# Altium project Discharge.PrjPcb
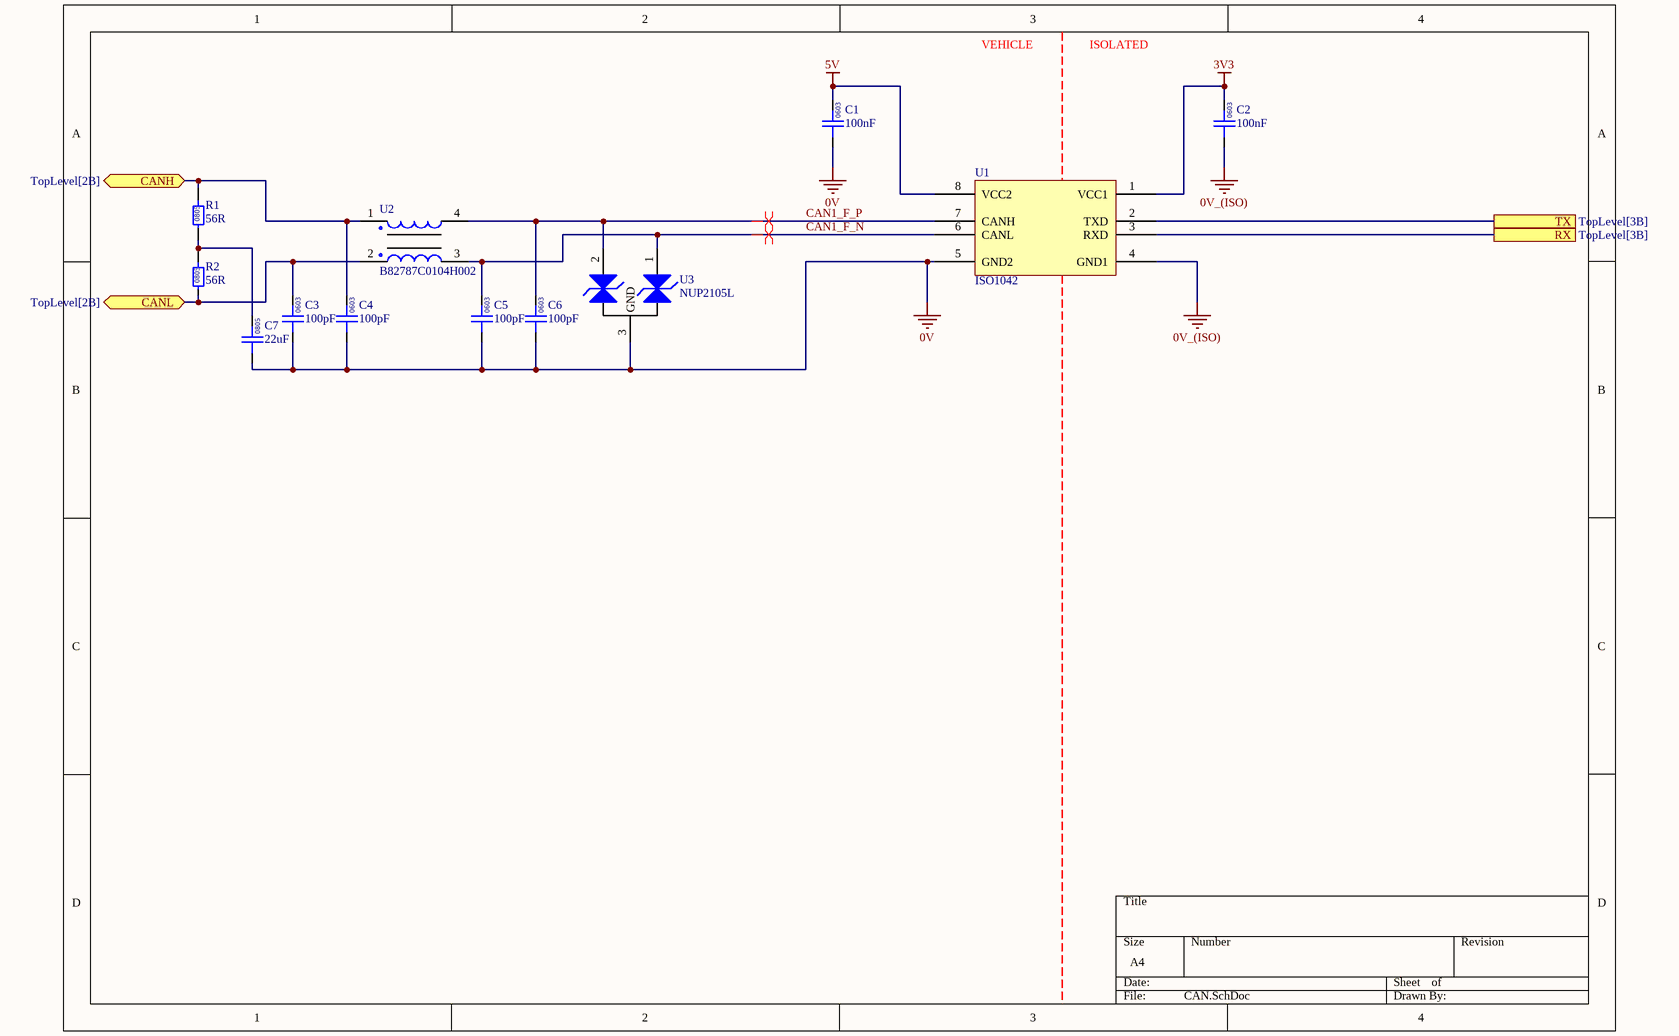
[diagram p0: CAN.SchDoc]
6 sheets, 94 parts. Net scope: flat (ports and power ports of the same name join across sheets).
Board files: Discharge_B1.PcbDoc, Discharge_B2.PcbDoc
Sheets:
  CAN.SchDoc
  Power Supply.SchDoc
  Safety Loop.SchDoc
  Discharge.SchDoc
  HV Sense.SchDoc
  TSAL.SchDoc

## Sheet CAN.SchDoc
size A4; SheetNumber: 2; SheetTotal: 11

### Parts
C1  100nF  [0603]
C2  100nF  [0603]
C3  100pF  [0603]
C4  100pF  [0603]
C5  100pF  [0603]
C6  100pF  [0603]
C7  22uF  [0805]
R1  56R  [0805]
R2  56R  [0805]
U1  ISO1042  [TI-SOIC-8]
U2  B82787C0104H002  [TDK 4-PC Pad]
U3  NUP2105L  [ON SOT-23]

### Ports
CANH (bidir, see TopLevel[2B]), CANL (bidir, see TopLevel[2B]), RX (see TopLevel[3B]), TX (see TopLevel[3B])

### Nets
0V: C1.1 C3.1 C4.1 C5.1 C6.1 C7.1 U1.5(GND2) U3.3(GND)
0V_(ISO): C2.1 U1.4(GND1)
3V3: C2.2 U1.1(VCC1)
5V: C1.2 U1.8(VCC2)
CAN1_F_N: C5.2 U1.6(CANL) U2.3 U3.1(CAN_H)
CAN1_F_P: C6.2 U1.7(CANH) U2.4 U3.2(CAN_L)
NetC3_2: C3.2 R2.1 U2.2 ; port CANL
NetC4_2: C4.2 R1.2 U2.1 ; port CANH
NetC7_2: C7.2 R1.1 R2.2
NetU1_2: U1.2(TXD) ; port TX
NetU1_3: U1.3(RXD) ; port RX

### Layout directives
differential pair: CAN1_F_N, CAN1_F_P

### Notes on the sheet
- VEHICLE
- ISOLATED
- (in symbol GCM188L81H104KA57D) 0603
- (in symbol GRM21BR61A226ME51L) 0805
- (in symbol GRM1885C1H101JA01D) 0603
- (in symbol RC0805FR0756RL) 0805

### Library data of the parts
C1 C2 = GCM188L81H104KA57D: Manufacturer: muRata; Rated Voltage: 50V; Tolerance: ±10%; Material: MLCC; Temperature Rating: X8L; Part Number: GCM188L81H104KA57D; Value: 100nF; Digikey Part Number: 490-6049-1-ND
C3-C6 = GRM1885C1H101JA01D: Manufacturer: Murata Electronics; Rated Voltage: 50V; Tolerance: ±5%; Material: MLCC; Temperature Rating: C0G, NP0; Part Number: GRM1885C1H101JA01D; Value: 100pF; Digikey Part Number: 490-1427-1-ND
C7 = GRM21BR61A226ME51L: Manufacturer: muRata; Rated Voltage: 10V; Tolerance: 20%; Material: MLCC; Temperature Rating: X5R; Part Number: GRM21BR61A226ME51L; Value: 22uF; Digikey Part Number: 490-10511-1-ND
R1 R2 = RC0805FR0756RL: Manufacturer: YAGEO; Tolerance: 0.01; Rated Power: 0.125W; Part Number: RC0805FR0756RL; Value: 56R; Material: FR-07; Digikey Part Number: 311-56.0CRCT-ND
U1 = ISO1042: IC CAN TRANSCEIVER 1/1 8SOIC; Manufacturer: Texas Instruments; Part Number: ISO1042; Digikey Part Number: 296-ISO1042BQDWVQ1-ND
U2 = B82787C0104H002: Manufacturer: EPCOS (TDK); Value: 100µH @ 100kHz; Impedance: 5.8 kOhms @ 10MHz; Rated Current: 150mA; Part Number: B82787C0104H002; Material: Wirewound; Digikey Part Number: 495-4598-1-ND
U3 = NUP2105L: Dual Line CAN Bus Protector; Manufacturer: ON Semiconductor; Part Number: NUP2105L; Digikey Part Number: NUP2105LT1GOSCT-ND; Digikey Link: https://www.digikey.com/product-detail/en/on-semiconductor/NUP2105LT1G/NUP2105LT1GOSCT-ND/1485001

## Sheet Power Supply.SchDoc
size A4; SheetNumber: 3; SheetTotal: 11
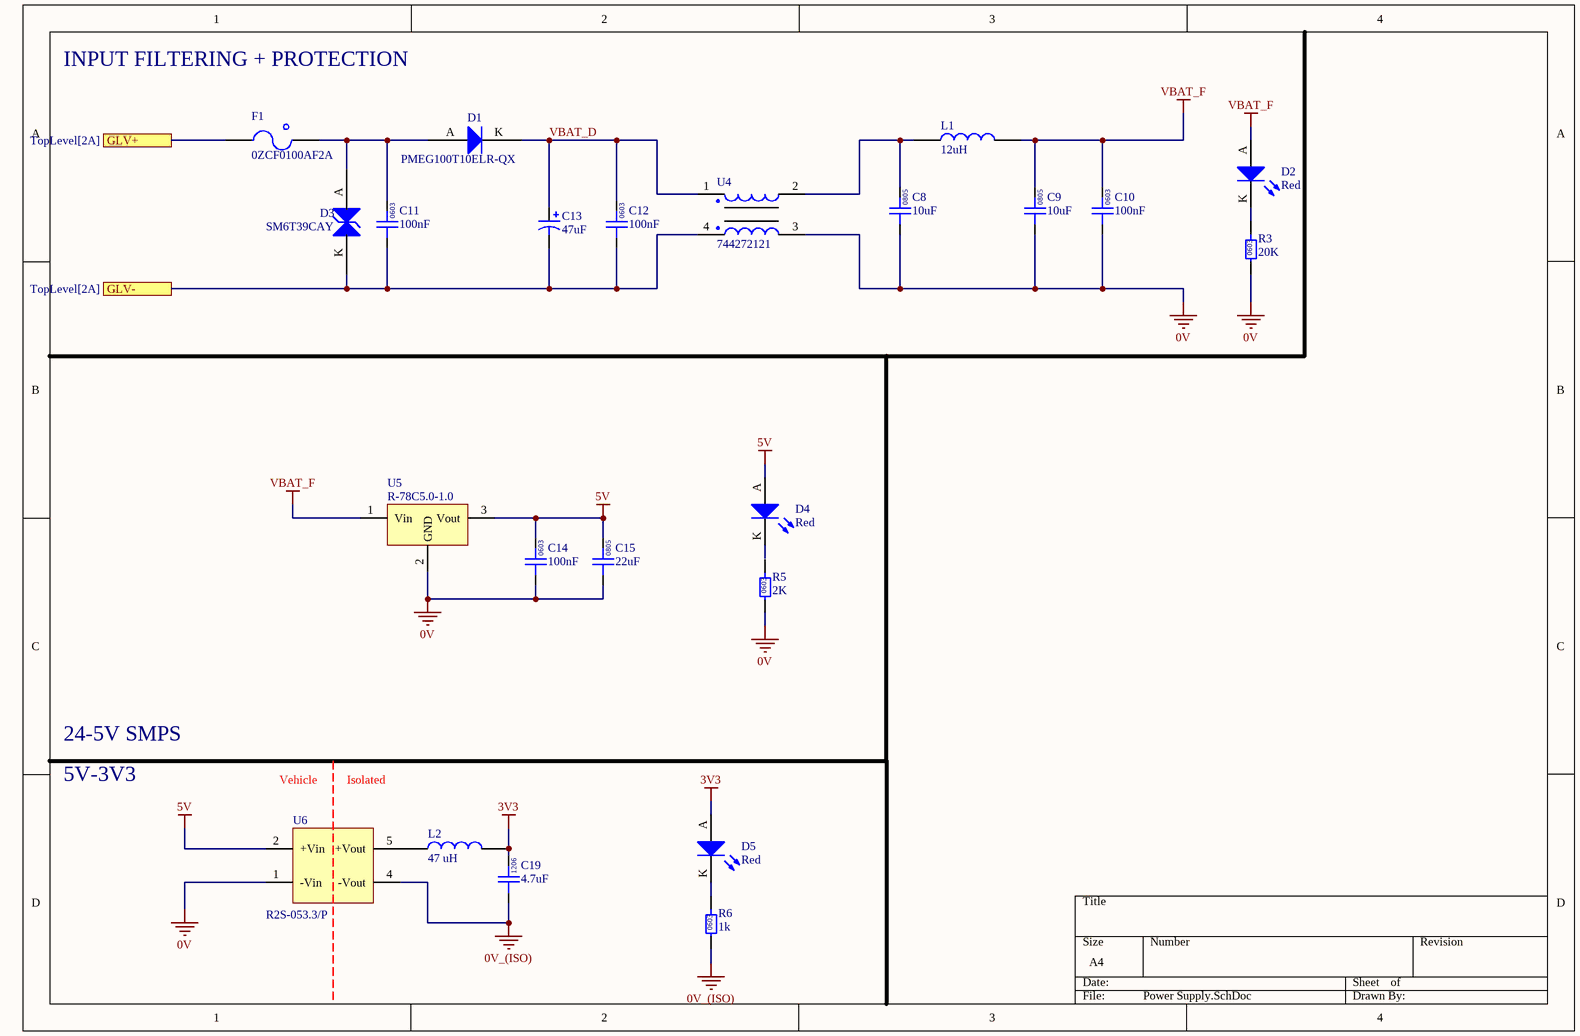
[diagram p1: Power Supply.SchDoc]

### Parts
C8  10uF  [0805]
C9  10uF  [0805]
C10  100nF  [0603]
C11  100nF  [0603]
C12  100nF  [0603]
C13  47uF  [CHEMI-CON ELCO]
C14  100nF  [0603]
C15  22uF  [0805]
C19  4.7uF  [1206 CAP]
D1  PMEG100T10ELR-QX  [SODFL350X110-2N]
D2  Red  [0805 LED]
D3  SM6T39CAY  [SM6T39CAY-Footprint-1]
D4  Red  [0805 LED]
D5  Red  [0805 LED]
F1  0ZCF0100AF2A  [2920]
L1  12uH  [1812]
L2  47 uH  [82473C]
R3  20K  [0603]
R5  2K  [0603]
R6  1k  [0603]
U4  744272121  [Wurth 4-PC Pad]
U5  R-78C5.0-1.0  [RECOM 3-SIP]
U6  R2S-053.3/P  [RECOM 8-SMD (5 Pin)]

### Ports
GLV+ (see TopLevel[2A]), GLV- (see TopLevel[2A])

### Nets
0V: C8.1 C9.1 C10.1 C14.1 C15.1 R3.1 R5.1 U4.3 U5.2(GND) U6.1(-Vin)
0V_(ISO): C19.1 R6.1 U6.4(-Vout)
3V3: C19.2 D5.A L2.1
5V: C14.2 C15.2 D4.A U5.3(Vout) U6.2(+Vin)
VBAT_F: C9.2 C10.2 D2.A L1.1 U5.1(Vin)
VBAT_D: C12.2 C13.2 D1.K U4.1
NetC8_2: C8.2 L1.2 U4.2
NetC11_1: C11.1 C12.1 C13.1 D3.K U4.4 ; port GLV-
NetC11_2: C11.2 D1.A D3.A F1.2
NetD2_K: D2.K R3.2
NetD5_K: D5.K R6.2
NetF1_1: F1.1 ; port GLV+
NetL2_2: L2.2 U6.5(+Vout)

Not connected (* = marked no-connect by the designer): D4 K; R5 2

### Notes on the sheet
- INPUT FILTERING + PROTECTION
- 24-5V SMPS
- 5V-3V3
- Vehicle
- Isolated
- (in symbol GCM188L81H104KA57D) 0603
- (in symbol GRM21BR6YA106KE43L) 0805
- (in symbol GRM21BR61A226ME51L) 0805
- (in symbol GRM31CR71H475KA12K) 1206
- (in symbol RC0603FR-071KL) 0603
- (in symbol RC0603FR-072KL) 0603
- (in symbol RC0603FR-0720KL) 0603

### Library data of the parts
C8 C9 = GRM21BR6YA106KE43L: Manufacturer: muRata; Rated Voltage: 50V; Tolerance: 10%; Material: MLCC; Temperature Rating: X5R; Part Number: GRM21BR6YA106KE43L; Value: 10uF; Digikey Part Number: 490-10514-6-ND
C10-C12 C14 = GCM188L81H104KA57D: as C1 on sheet CAN; Part Number: GCM188L81H104KA57D; Value: 100nF; Digikey Part Number: 490-6049-1-ND
C13 = HHXA350ARA470MF61G: Part Number: HHXA350ARA470MF61G
C15 = GRM21BR61A226ME51L: as C7 on sheet CAN; Part Number: GRM21BR61A226ME51L; Value: 22uF; Digikey Part Number: 490-10511-1-ND
C19 = GRM31CR71H475KA12K: Manufacturer: Murata Electronics; Rated Voltage: 50V; Tolerance: ±10%; Material: MLCC; Temperature Rating: X7R; Part Number: GRM31CR71H475KA12K; Value: 4.7uF; Digikey Part Number: 490-GRM31CR71H475KA12KTR-ND
D1 = CMP-004-00005-4: Diode 100 V 1A Surface Mount SOD-123W
D2 D4 D5 = SML-210LTT86: Red LED Indication - Discrete 1.75V 0805 (2012 Metric); Manufacturer: ROHM Semiconductor; Part Number: SML-210LTT86; Colour: Red; Digikey Part Number: 511-1286-1-ND
D3 = CMP-004-00003-4: TVS Diode Single Bi-Dir 33.3V 600W Automotive 2-Pin SMB T/R / TVS DIODE 33.3VWM 69.7VC SMB; Peak Pulse Current: 57A; Polarity: Bidirectional; Min Breakdown Voltage: 37.1V; Test Current: 1mA; Number of Elements: 1; Operating Supply Voltage: 30V; Diode Type: ZENER; Clamping Voltage: 53.9V; Leakage Current: 200nA; Power Line Protection: No; Max Surge Current: 11.1A; Max Breakdown Voltage: 41V; Breakdown Voltage: 39V; Max Power Dissipation: 600W; Radiation Hardening: No; Resistor Type: Zener; Termination: SMD/SMT; REACH SVHC: No SVHC; Reverse Breakdown Voltage: 37.1V; Max Operating Temperature: 150°C; Min Operating Temperature: -55°C; Element Configuration: Single; Length: 4.6mm; Case/Package: DO-214AA; Reverse Standoff Voltage: 33.3V; Number of Bidirectional Channels: 1; Number of Pins: 2; Direction: Bidirectional; Mount: Surface Mount; Package Quantity: 1; Width: 3.95mm; RoHS Compliant: Yes; Number of Channels: 1; Packaging: Tape and Reel; Max Reverse Leakage Current: 200nA; Peak Pulse Power: 600W; Height: 2.45mm; Series: Automotive, AEC-Q101, SM6TY, TRANSIL™
F1 = 0ZCF0100AF2A: PTC RESET FUSE 60V 1A 292; Manufacturer: Littelfuse Inc.; Part Number: 0ZCF0100AF2A; Digikey Part Number: 507-2070-1-ND; Digikey Link: https://www.digikey.com/product-detail/en/bel-fuse-inc/0ZCF0100AF2A/507-2070-1-ND/6210547
L1 = RLS-126: Manufacturer: Recom; Tolerance: 0.2; Impedance: 230mOhm; Rated Current: 0.8 A; Material: Wirewound; Part Number: RLS-126; Value: 12uH; Digikey Part Number: 945-3429-ND
L2 = 82473C: Manufacturer: Murata Power Solutions Inc.; Tolerance: 0.1; Impedance: 1.69 Ohms; Rated Current: 250mA; Material: Wirewound; Part Number: 82473C; Value: 47 uH; Digikey Part Number: 811-2477-2-ND
R3 = RC0603FR-0720KL: Manufacturer: YAGEO; Tolerance: 0.01; Rated Power: 0.1W; Part Number: RC0603FR-0720KL; Value: 20K; Digikey Part Number: 311-20.0KHRCT-ND; Material: FR-07
R5 = RC0603FR-072KL: Manufacturer: YAGEO; Tolerance: 0.01; Rated Power: 0.1W; Part Number: RC0603FR-072KL; Value: 2K; Digikey Part Number: 311-2.00KHRCT-ND; Material: FR-07
R6 = RC0603FR-071KL: Manufacturer: YAGEO; Tolerance: 0.01; Rated Power: 0.1W; Part Number: RC0603FR-071KL; Value: 1k; Digikey Part Number: 311-1.00KHRCT-ND; Material: FR-07
U4 = 744272121: Manufacturer: Wurth Electronics Inc; Value: 120uH @ 100kHz; Impedance: 460 Ohms @ 30MHz; Rated Current: 2.5 A; Part Number: 744272121; Material: Wirewound; Digikey Part Number: 732-1489-1-ND
U5 = R-78C5.0-1.0: CONV DC/DC 1A 5V OUT SIP VERT; Manufacturer: Recom; Input Voltage: 8 to 42 V; Output Current: 1.0 A; Part Number: R-78C5.0-1.0; Output Voltage: 5V; Digikey Part Number: 945-1395-5-ND
U6 = R2S-053.3/P: Isolated Module DC DC Converter 1 Output 3.3V 606mA 4.5V - 5.5V Input; Manufacturer: Recom; Part Number: R2S-053.3/P; Input Voltage: 4.5V-5.5V; Output Voltage: 3.3V; Output Current: 606mA; Digikey Part Number: 945-2677-5-ND

## Sheet Safety Loop.SchDoc
size A4; SheetNumber: 4; SheetTotal: 11
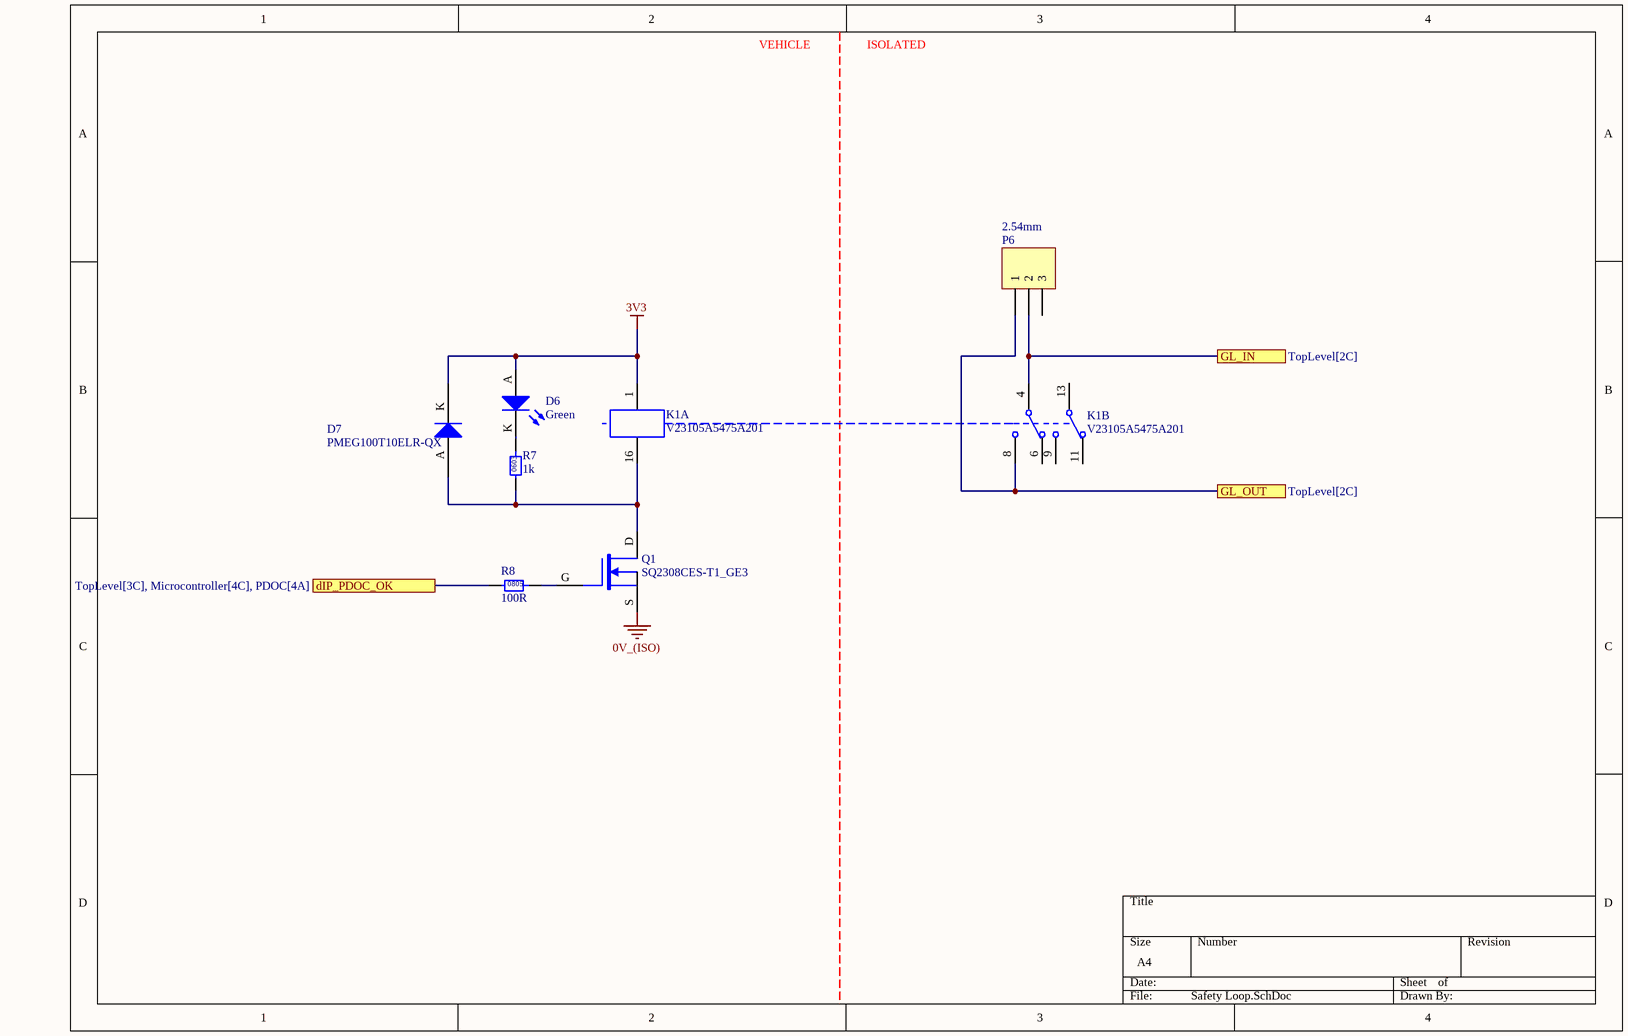
[diagram p2: Safety Loop.SchDoc]

### Parts
D6  Green  [0805 LED]
D7  PMEG100T10ELR-QX  [SODFL350X110-2N]
K1  V23105A5475A201  [TI 2-DIL]  (parts A,B of 2)
P6  2.54mm  [TH 2.54mm Header 1x3]
Q1  SQ2308CES-T1_GE3  [VSHY SOT-23-3]
R7  1k  [0603]
R8  100R  [0805]

### Ports
dIP_PDOC_OK (see TopLevel[3C], Microcontroller[4C], PDOC[4A]), GL_IN (see TopLevel[2C]), GL_OUT (see TopLevel[2C])

### Nets
0V_(ISO): Q1.S
3V3: D6.A D7.K K1.1
NetD6_K: D6.K R7.2
NetD7_A: D7.A K1.16 Q1.D R7.1
NetK1_4: K1.4 P6.2 ; port GL_IN
NetK1_8: K1.8 P6.1 ; port GL_OUT
NetQ1_G: Q1.G R8.2
NetR8_1: R8.1 ; port dIP_PDOC_OK

Not connected (* = marked no-connect by the designer): K1 6 9 11 13; P6 3

### Notes on the sheet
- VEHICLE
- ISOLATED
- (in symbol RC0603FR-071KL) 0603
- (in symbol RC0805FR07100RL) 0805

### Library data of the parts
D6 = SML-210FTT86: Green LED Indication - Discrete 1.75V 0805 (2012 Metric); Manufacturer: ROHM Semiconductor; Part Number: SML-210FTT86; Colour: Green; Digikey Part Number: 511-1285-1-ND
D7 = CMP-004-00005-4: Diode 100 V 1A Surface Mount SOD-123W
K1 = CMP-036-000001-1: 5V DPDT Relay 3A 220VDC; Part Number: V23105A5475A201
P6 = TH 2.54mm Header 1x3: Positions: 3; Angle: 0; Flange: No; Contact: NA; Part Number: TH 2.54mm Header 1x3; Pitch: 2.54mm; Row Spacing: 2.54mm
Q1 = SQ2308CES-T1_GE3: MOSFET N-CH 60V 2.3A SOT23; Manufacturer: Vishay Siliconix; Type: N-channel; Rated Power: 2W; Published: 24-Mar-1999; LatestRevisionDate: 29-May-2009; LatestRevisionNote: IPC-7351 Footprint Added.; PackageVersion: Sep-2000; PackageReference: SOT-343; Publisher: Altium Limited; PackageDescription: 4-Pin SOT-343 Package 1.3 mm Pitch, 2.1 mm Lead Span; Part Number: SQ2308CES-T1_GE3; Digikey Part Number: SQ2308CES-T1_GE3CT-ND
R7 = RC0603FR-071KL: as R6 on sheet Power Supply; Part Number: RC0603FR-071KL; Value: 1k; Digikey Part Number: 311-1.00KHRCT-ND; Material: FR-07
R8 = RC0805FR07100RL: Manufacturer: YAGEO; Tolerance: 0.01; Rated Power: 0.125W; Part Number: RC0805FR07100RL; Value: 100R; Material: FR-07; Digikey Part Number: 311-100CRCT-ND

## Sheet Discharge.SchDoc
size A4; SheetNumber: 5; SheetTotal: 11
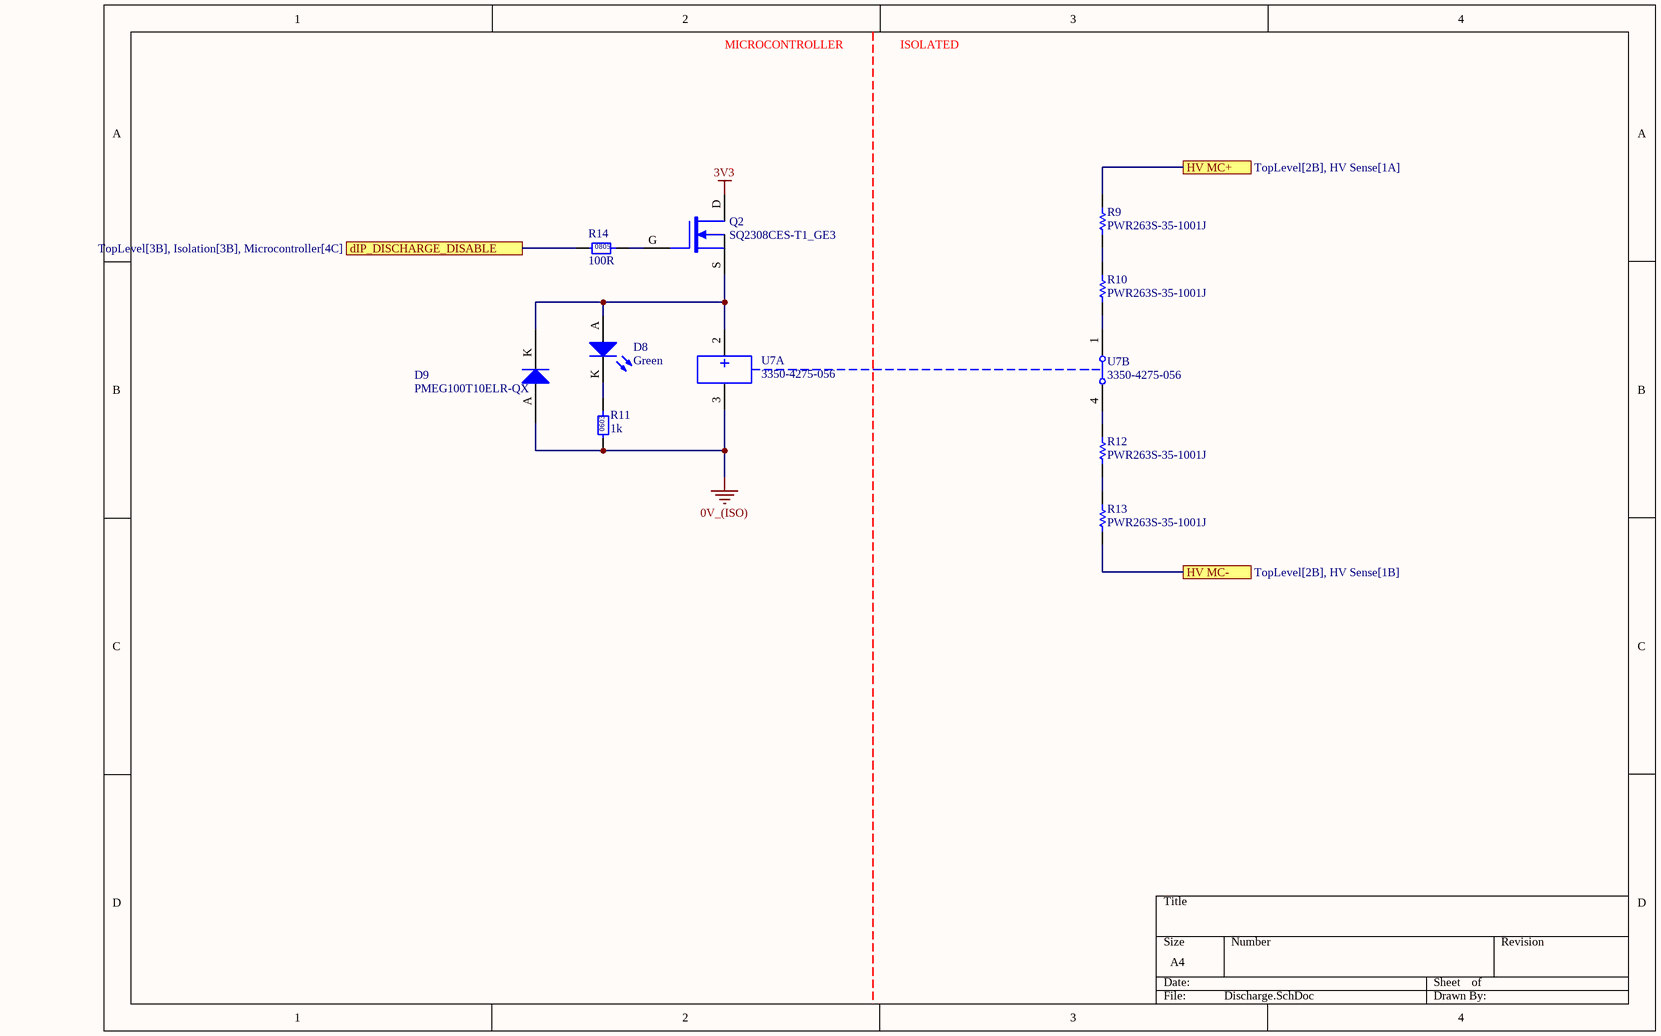
[diagram p3: Discharge.SchDoc]

### Parts
D8  Green  [0805 LED]
D9  PMEG100T10ELR-QX  [SODFL350X110-2N]
Q2  SQ2308CES-T1_GE3  [VSHY SOT-23-3]
R9  PWR263S-35-1001J  [B TO-263]
R10  PWR263S-35-1001J  [B TO-263]
R11  1k  [0603]
R12  PWR263S-35-1001J  [B TO-263]
R13  PWR263S-35-1001J  [B TO-263]
R14  100R  [0805]
U7  3350-4275-056  [CI SPST]  (parts A,B of 2)

### Ports
dIP_DISCHARGE_DISABLE (see TopLevel[3B], Isolation[3B], Microcontroller[4C]), HV MC+ (see TopLevel[2B], HV Sense[1A]), HV MC- (see TopLevel[2B], HV Sense[1B])

### Nets
0V_(ISO): D9.A R11.1 U7.3
3V3: Q2.D
HVGND: R13.2 ; port HV MC-
NetD8_A: D8.A D9.K Q2.S U7.2
NetD8_K: D8.K R11.2
NetQ2_G: Q2.G R14.2
NetR9_1: R9.1 ; port HV MC+
NetR9_2: R9.2 R10.1
NetR10_2: R10.2 U7.1
NetR12_1: R12.1 U7.4
NetR12_2: R12.2 R13.1
NetR14_1: R14.1 ; port dIP_DISCHARGE_DISABLE

### Notes on the sheet
- MICROCONTROLLER
- ISOLATED
- (in symbol RC0603FR-071KL) 0603
- (in symbol RC0805FR07100RL) 0805

### Library data of the parts
D8 = SML-210FTT86: as D6 on sheet Safety Loop; Part Number: SML-210FTT86; Colour: Green; Digikey Part Number: 511-1285-1-ND
D9 = CMP-004-00005-4: Diode 100 V 1A Surface Mount SOD-123W
Q2 = SQ2308CES-T1_GE3: as Q1 on sheet Safety Loop; Published: 24-Mar-1999; LatestRevisionDate: 29-May-2009; LatestRevisionNote: IPC-7351 Footprint Added.; PackageVersion: Sep-2000; PackageReference: SOT-343; Publisher: Altium Limited; PackageDescription: 4-Pin SOT-343 Package 1.3 mm Pitch, 2.1 mm Lead Span; Part Number: SQ2308CES-T1_GE3; Digikey Part Number: SQ2308CES-T1_GE3CT-ND
R9 R10 R12 R13 = CMP-037-000402-1: Manufacturer: Bournes Inc; Value: 1k; Rated Voltage: 35W; Tolerance: 0.05; Part Number: PWR263S-35-1001J; Digikey Part Number: PWR263S-35-1001J-ND
R11 = RC0603FR-071KL: as R6 on sheet Power Supply; Part Number: RC0603FR-071KL; Value: 1k; Digikey Part Number: 311-1.00KHRCT-ND; Material: FR-07
R14 = RC0805FR07100RL: as R8 on sheet Safety Loop; Part Number: RC0805FR07100RL; Value: 100R; Material: FR-07; Digikey Part Number: 311-100CRCT-ND
U7 = CMP-035-000005-1: RELAY REED HV SPST 200W 3A 5V (NC); Part Number: 3350-4275-056

## Sheet HV Sense.SchDoc
size A4; SheetNumber: 7; SheetTotal: 11
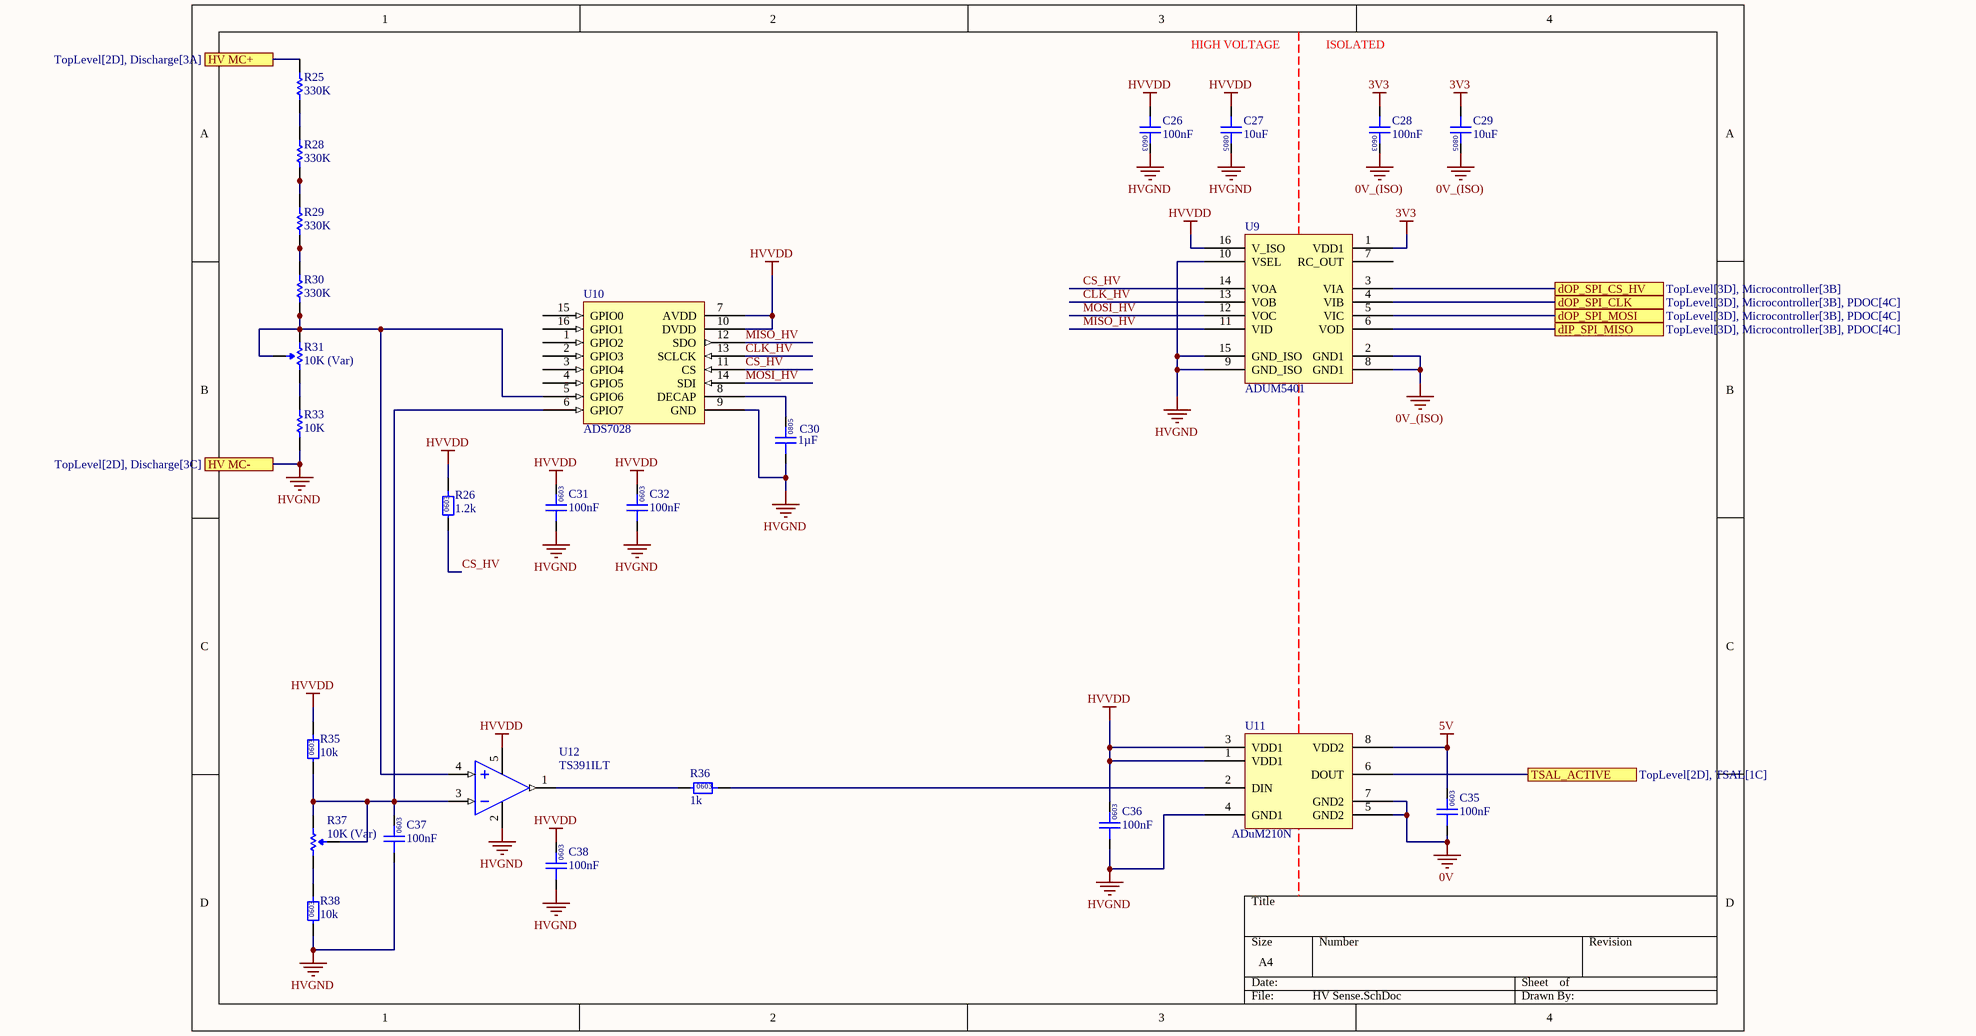
[diagram p4: HV Sense.SchDoc]

### Parts
C26  100nF  [0603]
C27  10uF  [0805]
C28  100nF  [0603]
C29  10uF  [0805]
C30  1µF  [0805]
C31  100nF  [0603]
C32  100nF  [0603]
C35  100nF  [0603]
C36  100nF  [0603]
C37  100nF  [0603]
C38  100nF  [0603]
R25  330K  [VB 0207]
R26  1.2k  [0603]
R28  330K  [VB 0207]
R29  330K  [VB 0207]
R30  330K  [VB 0207]
R31  10K (Var)  [B 3296]
R33  10K  [VB 0207]
R35  10k  [0603]
R36  1k  [0603]
R37  10K (Var)  [B 3296]
R38  10k  [0603]
U9  ADUM5401  [AD 16-SOIC]
U10  ADS7028  [WFQN-16]
U11  ADuM210N  [SOIC-8W]
U12  TS391ILT  [ON SOT-23-5]

### Ports
dIP_SPI_MISO (see TopLevel[3D], Microcontroller[3B], PDOC[4C]), dOP_SPI_CLK (see TopLevel[3D], Microcontroller[3B], PDOC[4C]), dOP_SPI_CS_HV (see TopLevel[3D], Microcontroller[3B]), dOP_SPI_MOSI (see TopLevel[3D], Microcontroller[3B], PDOC[4C]), HV MC+ (see TopLevel[2D], Discharge[3A]), HV MC- (see TopLevel[2D], Discharge[3C]), TSAL_ACTIVE (see TopLevel[2D], TSAL[1C])

### Nets
0V: C35.1 U11.5(GND2) U11.7(GND2)
0V_(ISO): C28.2 C29.2 U9.2(GND1) U9.8(GND1)
3V3: C28.1 C29.1 U9.1(VDD1)
5V: C35.2 U11.8(VDD2)
HVGND: C26.2 C27.2 C30.1 C31.1 C32.1 C36.1 C37.1 C38.1 R33.1 R38.1 U9.9(GND_ISO) U9.10(VSEL) U9.15(GND_ISO) U10.9(GND) U11.4(GND1) U12.2(VCC-) ; port HV MC-
HVVDD: C26.1 C27.1 C31.2 C32.2 C36.2 C38.2 R26.2 R35.2 U9.16(V_ISO) U10.7(AVDD) U10.10(DVDD) U11.1(VDD1) U11.3(VDD1) U12.5(VCC+)
CLK_HV: U9.13(VOB) U10.13(SCLCK)
CS_HV: R26.1 U9.14(VOA) U10.11(CS)
MISO_HV: U9.11(VID) U10.12(SDO)
MOSI_HV: U9.12(VOC) U10.14(SDI)
NetC30_2: C30.2 U10.8(DECAP)
NetC37_2: C37.2 R35.1 R37.1(CCW) R37.2(Wiper) U10.6(GPIO7) U12.3(IN-)
NetR9_1: R25.2 ; port HV MC+
NetR25_1: R25.1 R28.2
NetR28_1: R28.1 R29.2
NetR29_1: R29.1 R30.2
NetR30_1: R30.1 R31.2(Wiper) R31.3(CW) U10.5(GPIO6) U12.4(IIN+)
NetR31_1: R31.1(CCW) R33.2
NetR36_1: R36.1 U12.1(OUT)
NetR36_2: R36.2 U11.2(DIN)
NetR37_3: R37.3(CW) R38.2
NetR55_1: U11.6(DOUT) ; port TSAL_ACTIVE
NetU9_3: U9.3(VIA) ; port dOP_SPI_CS_HV
NetU9_4: U9.4(VIB) ; port dOP_SPI_CLK
NetU9_5: U9.5(VIC) ; port dOP_SPI_MOSI
NetU9_6: U9.6(VOD) ; port dIP_SPI_MISO

Not connected (* = marked no-connect by the designer): U9 7(RC_OUT); U10 1(GPIO2) 2(GPIO3) 3(GPIO4) 4(GPIO5) 15(GPIO0) 16(GPIO1)

### Notes on the sheet
- HIGH VOLTAGE
- ISOLATED
- (in symbol GCM21BR71H105KA03L) 0805
- (in symbol GCM188L81H104KA57D) 0603
- (in symbol GRM21BR6YA106KE43L) 0805
- (in symbol RC0603FR-071KL) 0603
- (in symbol RC0603FR-0710KL) 0603
- (in symbol RC0603JR-071K2L) 0603

### Library data of the parts
C26 C28 C31 C32 C35-C38 = GCM188L81H104KA57D: as C1 on sheet CAN; Part Number: GCM188L81H104KA57D; Value: 100nF; Digikey Part Number: 490-6049-1-ND
C27 C29 = GRM21BR6YA106KE43L: as C8 on sheet Power Supply; Part Number: GRM21BR6YA106KE43L; Value: 10uF; Digikey Part Number: 490-10514-6-ND
C30 = GCM21BR71H105KA03L: Manufacturer: muRata; Rated Voltage: 50V; Tolerance: ±10%; Material: MLCC; Temperature Rating: X7R; Part Number: GCM21BR71H105KA03L; Value: 1µF; Digikey Part Number: 490-10675-1-ND
R25 R28-R30 = MMB02070C3303FB200: Manufacturer: Vishay Beyschlag; Tolerance: 0.01; Rated Power: 1W; Part Number: MMB02070C3303FB200; Value: 330K; Digikey Part Number: MMB-330KBCT-ND
R26 = RC0603JR-071K2L: Manufacturer: YAGEO; Tolerance: 0.01; Rated Power: 0.1W; Part Number: RC0603JR-071K2L; Value: 1.2k; Material: FR-07; Digikey Part Number: 311-1.2KGRCT-ND
R31 R37 = 3296W-1-103LF: Manufacturer: Bournes Inc; Tolerance: 0.1; Rated Power: 0.5W; Part Number: 3296W-1-103LF; Value: 10K (Var); Digikey Part Number: 3296W-103LF-ND
R33 = MMB02070C1003FB200: Manufacturer: Vishay Beyschlag; Tolerance: 0.01; Rated Power: 1W; Part Number: MMB02070C1003FB200; Value: 10K; Digikey Part Number: MMB-10KBCT-ND
R35 R38 = RC0603FR-0710KL: Manufacturer: YAGEO; Tolerance: 0.01; Rated Power: 0.1W; Part Number: RC0603FR-0710KL; Value: 10k; Digikey Part Number: 311-10.0KHRCT-ND; Material: FR-07
R36 = RC0603FR-071KL: as R6 on sheet Power Supply; Part Number: RC0603FR-071KL; Value: 1k; Digikey Part Number: 311-1.00KHRCT-ND; Material: FR-07
U9 = ADUM5401: Quad Channel 2.5kV Digital Isolator with isoPower; Manufacturer: Analogue Devices; Part Number: ADUM5401
U10 = ADS7028IRTER: IC ADC 12BIT SAR 16WQFN; Manufacturer: Texas Instruments; Part Number: ADS7028IRTER; Digikey Part Number: ADS7028IRTER; Digikey Link: https://www.digikey.com.au/en/products/detail/texas-instruments/ADS7028IRTER/12696020?s=N4IgTCBcDaIIIBEDKB2ADGAHASQEoBUBRXEAXQF8g
U11 = CMP-110-000007-1: DIGITAL ISOLATOR, SINGLE CHANNEL; Digikey Link: #https://www.analog.com/media/en/technical-documentation/data-sheets/ADuM210N.pdf#; Part Number: ADuM210N
U12 = CMP-022-000013-1: IC COMP LO PWR SGL V SOT 23-5L; Part Number: TS391ILT

## Sheet TSAL.SchDoc
size A4; SheetNumber: 9; SheetTotal: 11
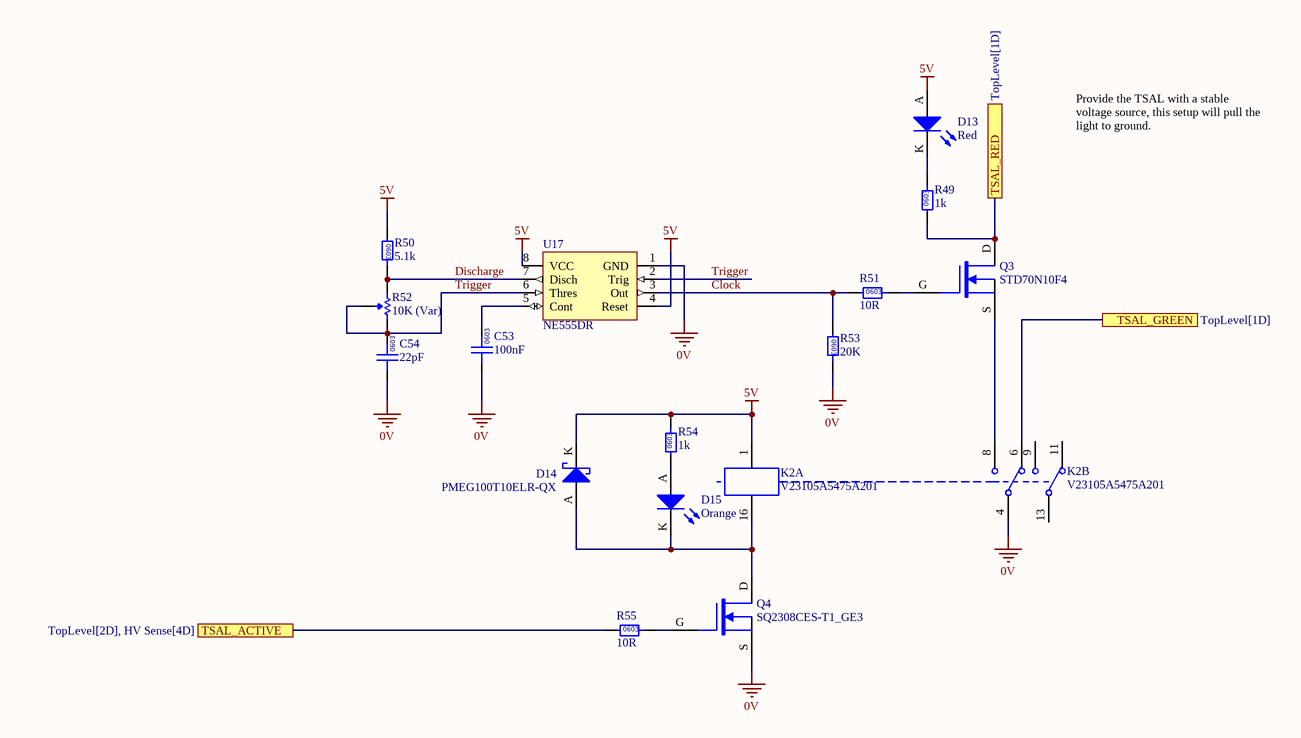
[diagram p5: TSAL.SchDoc]

### Parts
C53  100nF  [0603]
C54  22pF  [0603]
D13  Red  [0805 LED]
D14  PMEG100T10ELR-QX  [NXP SOD123W]
D15  Orange  [0805 LED]
K2  V23105A5475A201  [TI 2-DIL]  (parts A,B of 2)
Q3  STD70N10F4  [STM TO-252 MOSFET]
Q4  SQ2308CES-T1_GE3  [VSHY SOT-23-3]
R49  1k  [0603]
R50  5.1k  [0603]
R51  10R  [0603]
R52  10K (Var)  [B 3296]
R53  20K  [0603]
R54  1k  [0603]
R55  10R  [0603]
U17  NE555DR  [TI 8-SOIC]

### Ports
TSAL_ACTIVE (see TopLevel[2D], HV Sense[4D]), TSAL_GREEN (see TopLevel[1D]), TSAL_RED (see TopLevel[1D])

### Nets
0V: C53.1 C54.1 K2.4 Q4.S R53.2 U17.1(GND)
5V: D13.A D14.K K2.1 R50.1 R54.2 U17.4(Reset) U17.8(VCC)
Clock: R51.1 R53.1 U17.3(Out)
Discharge: R50.2 R52.3(CW) U17.7(Disch)
Trigger: C54.2 R52.1(CCW) R52.2(Wiper) U17.2(Trig) U17.6(Thres)
NetC53_2: C53.2 U17.5(Cont)
NetD13_K: D13.K R49.2
NetD14_A: D14.A D15.K K2.16 Q4.D
NetD15_A: D15.A R54.1
NetK2_6: K2.6 ; port TSAL_GREEN
NetK2_8: K2.8 Q3.S
NetQ3_D: Q3.D R49.1 ; port TSAL_RED
NetQ3_G: Q3.G R51.2
NetQ4_G: Q4.G R55.2
NetR55_1: R55.1 ; port TSAL_ACTIVE

Not connected (* = marked no-connect by the designer): K2 9 11 13

### Notes on the sheet
- Provide the TSAL with a stable voltage source, this setup will pull the light to ground.
- (in symbol GCM188L81H104KA57D) 0603
- (in symbol GRM0335C1H220JA01D) 0603
- (in symbol RC0603FR-071KL) 0603
- (in symbol RC0603FR-0710RL) 0603
- (in symbol RC0603FR-0720KL) 0603
- (in symbol RC0603JR-075K1L) 0603

### Library data of the parts
C53 = GCM188L81H104KA57D: as C1 on sheet CAN; Part Number: GCM188L81H104KA57D; Value: 100nF; Digikey Part Number: 490-6049-1-ND
C54 = GRM0335C1H220JA01D: Manufacturer: Murata Electronics; Rated Voltage: 50V; Tolerance: ±5%; Material: MLCC; Temperature Rating: C0G, NP0; Part Number: GRM0335C1H220JA01D; Value: 22pF; Digikey Part Number: 490-6123-1-ND
D13 = SML-210LTT86: as D2 on sheet Power Supply; Part Number: SML-210LTT86; Colour: Red; Digikey Part Number: 511-1286-1-ND
D14 = PMEG100T10ELR-QX: Manufacturer: Nexperia USA Inc.; Forward Voltage: 0.75 V @ 1A; Breakdown Voltage: 100 V; Rated Power: 680 mW; Part Number: PMEG100T10ELR-QX; Digikey Part Number: 1727-PMEG100T10ELR-QXCT-ND
D15 = SML-211DTT86: Orange LED Indication - Discrete 1.75V 0805 (2012 Metric); Manufacturer: ROHM Semiconductor; Part Number: SML-211DTT86; Colour: Orange; Digikey Part Number: 511-1291-1-ND
K2 = CMP-036-000001-1: 5V DPDT Relay 3A 220VDC; Part Number: V23105A5475A201
Q3 = STD70N10F4: N-Channel 100V 60A (Tc) 125W (Tc) Surface Mount DPAK; Manufacturer: STMicroelectronics; Published: 24-Mar-1999; LatestRevisionDate: 29-May-2009; LatestRevisionNote: IPC-7351 Footprint Added.; PackageVersion: Sep-2000; PackageReference: SOT-343; Publisher: Altium Limited; PackageDescription: 4-Pin SOT-343 Package 1.3 mm Pitch, 2.1 mm Lead Span; Part Number: STD70N10F4; Type: N-channel; Rated Power: 125W; Digikey Part Number: 497-8806-2-ND
Q4 = SQ2308CES-T1_GE3: as Q1 on sheet Safety Loop; Published: 24-Mar-1999; LatestRevisionDate: 29-May-2009; LatestRevisionNote: IPC-7351 Footprint Added.; PackageVersion: Sep-2000; PackageReference: SOT-343; Publisher: Altium Limited; PackageDescription: 4-Pin SOT-343 Package 1.3 mm Pitch, 2.1 mm Lead Span; Part Number: SQ2308CES-T1_GE3; Digikey Part Number: SQ2308CES-T1_GE3CT-ND
R49 R54 = RC0603FR-071KL: as R6 on sheet Power Supply; Part Number: RC0603FR-071KL; Value: 1k; Material: FR-07; Digikey Part Number: 311-1.00KHRCT-ND
R50 = RC0603JR-075K1L: Manufacturer: YAGEO; Tolerance: 0.01; Rated Power: 0.1W; Part Number: RC0603JR-075K1L; Value: 5.1k; Material: FR-07; Digikey Part Number: 311-5.1KGRCT-ND
R51 R55 = RC0603FR-0710RL: Manufacturer: YAGEO; Tolerance: 0.01; Rated Power: 0.1W; Part Number: RC0603FR-0710RL; Value: 10R; Material: FR-07; Digikey Part Number: 311-10.0HRCT-ND
R52 = 3296W-1-103LF: as R31 on sheet HV Sense; Part Number: 3296W-1-103LF; Value: 10K (Var); Digikey Part Number: 3296W-103LF-ND
R53 = RC0603FR-0720KL: as R3 on sheet Power Supply; Part Number: RC0603FR-0720KL; Value: 20K; Material: FR-07; Digikey Part Number: 311-20.0KHRCT-ND
U17 = CMP-022-000003-1: IC OSC SGL TIMER 100KHZ 8-SOIC; Part Number: NE555DR

## Nets that join several sheets
0V: CAN (8 pins), Power Supply (10 pins), HV Sense (C35.1 U11.5 U11.7), TSAL (6 pins)
0V_(ISO): CAN (C2.1 U1.4), Power Supply (C19.1 R6.1 U6.4), Safety Loop (Q1.S), Discharge (D9.A R11.1 U7.3), HV Sense (C28.2 C29.2 U9.2 U9.8)
3V3: CAN (C2.2 U1.1), Power Supply (C19.2 D5.A L2.1), Safety Loop (D6.A D7.K K1.1), Discharge (Q2.D), HV Sense (C28.1 C29.1 U9.1)
5V: CAN (C1.2 U1.8), Power Supply (5 pins), HV Sense (C35.2 U11.8), TSAL (7 pins)
HVGND: Discharge (R13.2), HV Sense (16 pins)
NetR9_1: Discharge (R9.1), HV Sense (R25.2)
NetR55_1: HV Sense (U11.6), TSAL (R55.1)